# EAGLE design sensor_board011 (EAGLE 4.16)

## Sheet 1 of 2
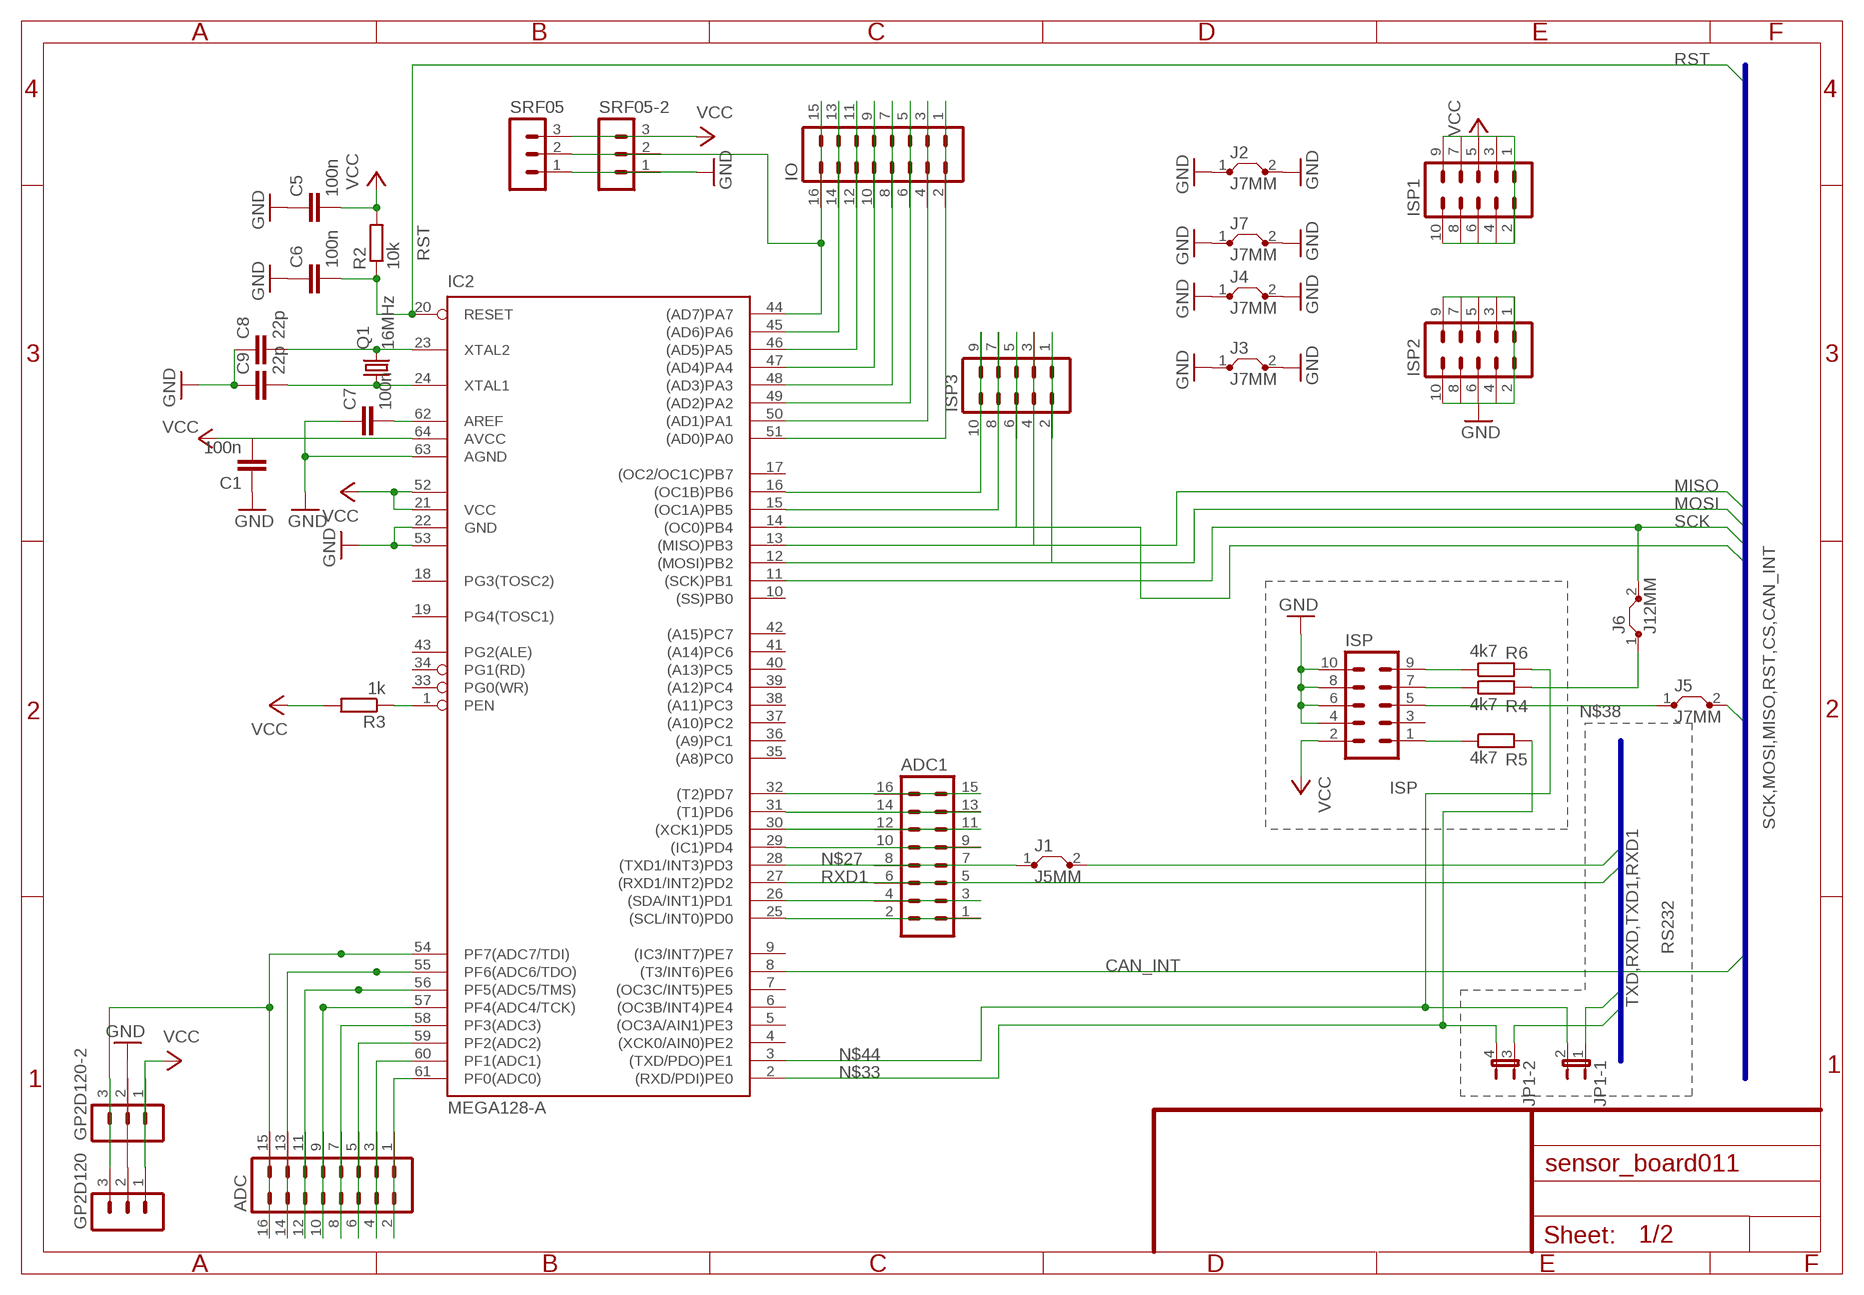
[diagram p0: schematic, sheet 1]

### Parts
ADC  MA08-2  [MA08-2]
ADC1  MA08-2  [MA08-2]
C1  100n  C-EUC0603  [C0603]
C5  100n  C-EUC0603  [C0603]
C6  100n  C-EUC0603  [C0603]
C7  100n  C-EUC0603  [C0603]
C8  22p  C-EUC0603  [C0603]
C9  22p  C-EUC0603  [C0603]
GP2D120  MA03-1  [MA03-1]
GP2D120-2  MA03-1  [MA03-1]
IC2  MEGA128-A  [TQFP64]
IO  MA08-2  [MA08-2]
ISP  MA05-2  [MA05-2]
ISP1  MA05-2  [MA05-2]
ISP2  MA05-2  [MA05-2]
ISP3  MA05-2  [MA05-2]
J1  J5MM  [05]
J2  J7MM  [07]
J3  J7MM  [07]
J4  J7MM  [07]
J5  J7MM  [07]
J6  J12MM  [12]
J7  J7MM  [07]
JP1  JP2QE  [JP2Q]
Q1  16MHz  CRYSTALHC49U-V  [HC49U-V]
R2  10k  R-EU_R0805  [R0805]
R3  1k  R-EU_R0805  [R0805]
R4  4k7  R-EU_R0805  [R0805]
R5  4k7  R-EU_R0805  [R0805]
R6  4k7  R-EU_R0805  [R0805]
SRF05  MA03-1  [MA03-1]
SRF05-2  MA03-1  [MA03-1]

### Nets
CAN_INT: IC2.8((T3/INT6)PE6) ; also sheet 2
CS: IC2.14((OC0)PB4) ISP3.5 ISP3.6 ; also sheet 2
GND: C1.1 C5.1 C6.1 C7.1 C8.1 C9.1 GP2D120-2.2 GP2D120.2 IC2.22(GND) IC2.53(GND1) IC2.63(AGND) ISP2.1 ISP2.2 ISP2.3 ISP2.4 ISP2.5 ISP2.6 ISP2.7 ISP2.8 ISP2.9 ISP2.10 ISP.4 ISP.6 ISP.8 ISP.10 J2.1 J2.2 J3.1 J3.2 J4.1 J4.2 J7.1 J7.2 SRF05-2.1 SRF05.1 ; also sheet 2
MISO: IC2.13((MISO)PB3) ISP3.3 ISP3.4 ; also sheet 2
MOSI: IC2.12((MOSI)PB2) ISP3.1 ISP3.2 ; also sheet 2
N$1: ADC.1 ADC.2 IC2.61(PF0(ADC0))
N$3: ADC.3 ADC.4 IC2.60(PF1(ADC1))
N$4: ADC.5 ADC.6 IC2.59(PF2(ADC2))
N$5: C7.2 IC2.62(AREF)
N$6: C9.2 IC2.24(XTAL1) Q1.1
N$7: C8.2 IC2.23(XTAL2) Q1.2
N$9: ADC.7 ADC.8 IC2.58(PF3(ADC3))
N$11: ADC.9 ADC.10 IC2.57(PF4(ADC4/TCK))
N$14: ADC.11 ADC.12 IC2.56(PF5(ADC5/TMS))
N$15: ADC.13 ADC.14 IC2.55(PF6(ADC6/TDO))
N$19: ADC.15 ADC.16 GP2D120-2.3 GP2D120.3 IC2.54(PF7(ADC7/TDI))
N$20: IC2.45((AD6)PA6) IO.13 IO.14
N$22: ISP.9 R6.1
N$24: IC2.46((AD5)PA5) IO.11 IO.12
N$25: ISP.1 R5.1
N$26: IC2.1(PEN) R3.1
N$27: ADC1.7 ADC1.8 IC2.28((TXD1/INT3)PD3) J1.1
N$28: IC2.47((AD4)PA4) IO.9 IO.10
N$29: ISP.7 R4.1
N$31: IC2.48((AD3)PA3) IO.7 IO.8
N$32: IC2.49((AD2)PA2) IO.5 IO.6
N$33: IC2.2((RXD/PDI)PE0) JP1.4 R5.2
N$34: IC2.50((AD1)PA1) IO.3 IO.4
N$35: IC2.51((AD0)PA0) IO.1 IO.2
N$38: ISP.5 J5.1
N$44: IC2.3((TXD/PDO)PE1) JP1.2 R6.2
N$47: IC2.44((AD7)PA7) IO.15 IO.16 SRF05-2.2 SRF05.2
N$48: J6.1 R4.2
N$52: IC2.15((OC1A)PB5) ISP3.7 ISP3.8
N$60: IC2.16((OC1B)PB6) ISP3.9 ISP3.10
N$61: ADC1.1 ADC1.2 IC2.25((SCL/INT0)PD0)
N$62: ADC1.3 ADC1.4 IC2.26((SDA/INT1)PD1)
N$63: ADC1.9 ADC1.10 IC2.29((IC1)PD4)
N$64: ADC1.11 ADC1.12 IC2.30((XCK1)PD5)
N$65: ADC1.13 ADC1.14 IC2.31((T1)PD6)
N$66: ADC1.15 ADC1.16 IC2.32((T2)PD7)
RST: C6.2 IC2.20(RESET) J5.2 R2.1 ; also sheet 2
RXD: JP1.3 ; also sheet 2
RXD1: ADC1.5 ADC1.6 IC2.27((RXD1/INT2)PD2) ; also sheet 2
SCK: IC2.11((SCK)PB1) J6.2 ; also sheet 2
TXD: JP1.1 ; also sheet 2
TXD1: J1.2 ; also sheet 2
VCC: C1.2 C5.2 GP2D120-2.1 GP2D120.1 IC2.21(VCC) IC2.52(VCC1) IC2.64(AVCC) ISP1.1 ISP1.2 ISP1.3 ISP1.4 ISP1.5 ISP1.6 ISP1.7 ISP1.8 ISP1.9 ISP1.10 ISP.2 R2.2 R3.2 SRF05-2.3 SRF05.3 ; also sheet 2
Unconnected: IC2.4((XCK0/AIN0)PE2) IC2.5((OC3A/AIN1)PE3) IC2.6((OC3B/INT4)PE4) IC2.7((OC3C/INT5)PE5) IC2.9((IC3/INT7)PE7) IC2.10((SS)PB0) IC2.17((OC2/OC1C)PB7) IC2.18(PG3(TOSC2)) IC2.19(PG4(TOSC1)) IC2.33(PG0(WR)) IC2.34(PG1(RD)) IC2.35((A8)PC0) IC2.36((A9)PC1) IC2.37((A10)PC2) IC2.38((A11)PC3) IC2.39((A12)PC4) IC2.40((A13)PC5) IC2.41((A14)PC6) IC2.42((A15)PC7) IC2.43(PG2(ALE)) ISP.3

### Buses
SCK,MOSI,MISO,RST,CS,CAN_INT
TXD,RXD,TXD1,RXD1

### Notes on the sheet
- ISP
- RS232

## Sheet 2 of 2
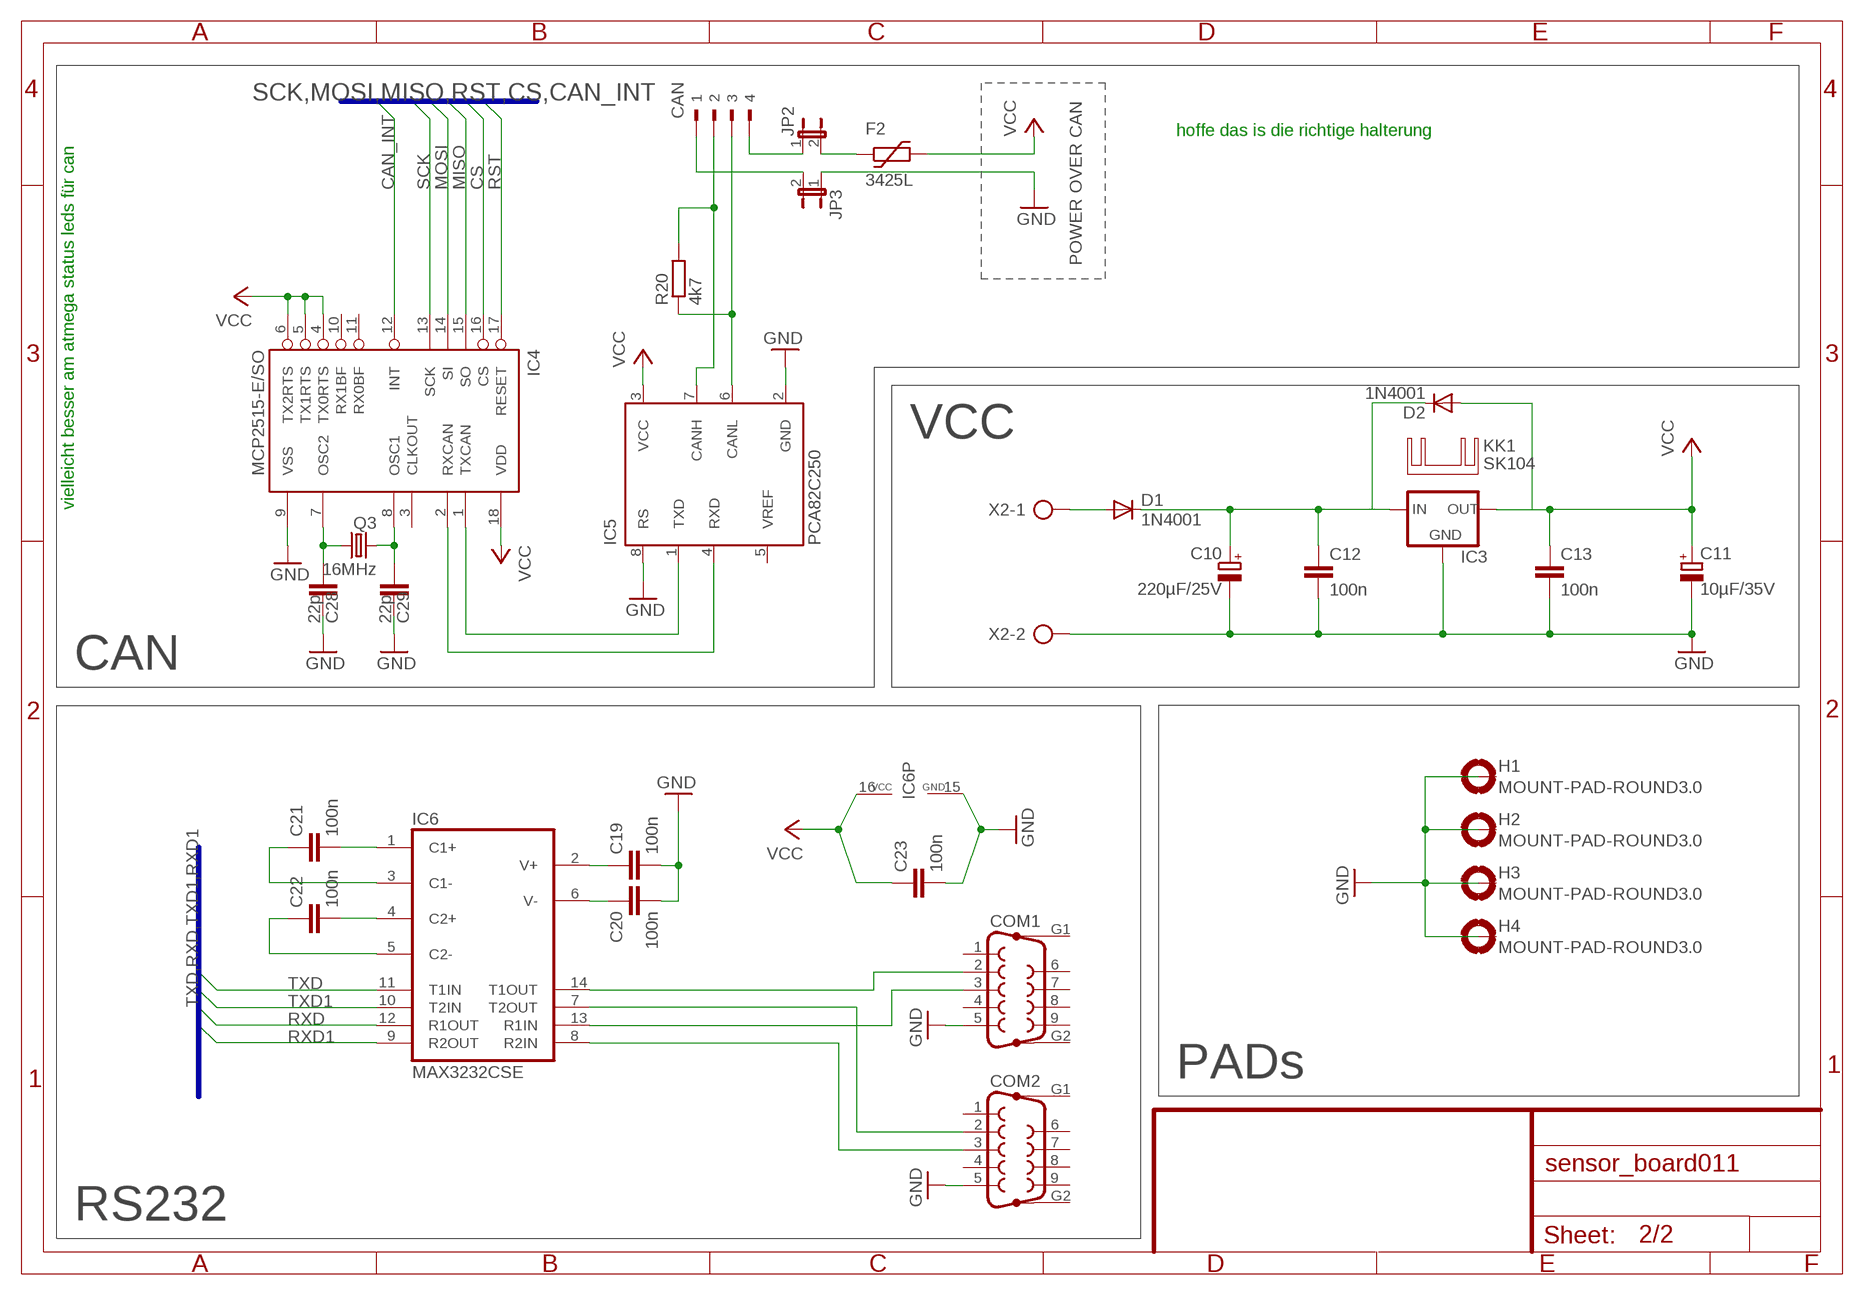
[diagram p1: schematic, sheet 2]

### Parts
C10  220µF/25V  CPOL-EUE3.5-8  [E3,5-8]
C11  10µF/35V  CPOL-EUE2-5  [E2-5]
C12  100n  C-EUC0603  [C0603]
C13  100n  C-EUC0603  [C0603]
C19  100n  C-EUC0603  [C0603]
C20  100n  C-EUC0603  [C0603]
C21  100n  C-EUC0603  [C0603]
C22  100n  C-EUC0603  [C0603]
C23  100n  C-EUC0603  [C0603]
C28  22p  C-EUC0603  [C0603]
C29  22p  C-EUC0603  [C0603]
CAN  90-4  [90-4]
COM1  F09HP  [F09HP]
COM2  F09HP  [F09HP]
D1  1N4001  DIODE-DO41-10  [DO41-10]
D2  1N4001  DIODE-DO41-10  [DO41-10]
F2  3425L  [3425L]
H1  MOUNT-PAD-ROUND3.0  [3,0-PAD]
H2  MOUNT-PAD-ROUND3.0  [3,0-PAD]
H3  MOUNT-PAD-ROUND3.0  [3,0-PAD]
H4  MOUNT-PAD-ROUND3.0  [3,0-PAD]
IC3  78XXS  [78XXS]
IC4  MCP2515-E/SO  [SO18L]
IC5  PCA82C250  [DIL08]
IC6  MAX3232CSE  [SO16]
JP2  JP1E  [JP1]
JP3  JP1E  [JP1]
KK1  SK104  [SK104]
Q3  16MHz  CRYSTALHC49U-V  [HC49U-V]
R20  4k7  R-EU_R0805  [R0805]
X2  AK500/2-H  [AK500/2-H]

### Nets
CAN_INT: IC4.12(INT) ; also sheet 1
CS: IC4.16(CS) ; also sheet 1
GND: C10.- C11.- C12.2 C13.2 C19.2 C20.2 C23.2 C28.2 C29.2 COM1.5 COM2.5 H1.B3,0(MOUNT) H2.B3,0(MOUNT) H3.B3,0(MOUNT) H4.B3,0(MOUNT) IC3.GND IC4.9(VSS) IC5.2(GND) IC5.8(RS) IC6.15(GND) JP3.1 X2.2 ; also sheet 1
MISO: IC4.15(SO) ; also sheet 1
MOSI: IC4.14(SI) ; also sheet 1
N$2: IC4.1(TXCAN) IC5.1(TXD)
N$8: C10.+ C12.1 D1.C D2.C IC3.IN
N$10: D1.A X2.1
N$12: COM1.2 IC6.14(T1OUT)
N$13: COM1.3 IC6.13(R1IN)
N$16: CAN.4 JP2.1
N$17: C21.2 IC6.1(C1+)
N$21: IC4.2(RXCAN) IC5.4(RXD)
N$23: CAN.3 IC5.6(CANL) R20.1
N$30: C22.2 IC6.4(C2+)
N$36: C22.1 IC6.5(C2-)
N$37: C21.1 IC6.3(C1-)
N$40: COM2.2 IC6.7(T2OUT)
N$41: COM2.3 IC6.8(R2IN)
N$43: C19.1 IC6.2(V+)
N$46: C20.1 IC6.6(V-)
N$49: F2.P$1 JP2.2
N$50: CAN.1 JP3.2
N$53: C28.1 IC4.7(OSC2) Q3.1
N$54: C29.1 IC4.8(OSC1) Q3.2
N$59: CAN.2 IC5.7(CANH) R20.2
RST: IC4.17(RESET) ; also sheet 1
RXD: IC6.12(R1OUT) ; also sheet 1
RXD1: IC6.9(R2OUT) ; also sheet 1
SCK: IC4.13(SCK) ; also sheet 1
TXD: IC6.11(T1IN) ; also sheet 1
TXD1: IC6.10(T2IN) ; also sheet 1
VCC: C11.+ C13.1 C23.1 D2.A F2.P$2 IC3.OUT IC4.4(TX0RTS) IC4.5(TX1RTS) IC4.6(TX2RTS) IC4.18(VDD) IC5.3(VCC) IC6.16(VCC) ; also sheet 1
Unconnected: COM1.1 COM1.4 COM1.6 COM1.7 COM1.8 COM1.9 COM1.G1 COM1.G2 COM2.1 COM2.4 COM2.6 COM2.7 COM2.8 COM2.9 COM2.G1 COM2.G2 IC4.3(CLKOUT) IC4.10(RX1BF) IC4.11(RX0BF) IC5.5(VREF)

### Buses
SCK,MOSI,MISO,RST,CS,CAN_INT
TXD,RXD,TXD1,RXD1

### Notes on the sheet
- POWER OVER CAN
- hoffe das is die richtige halterung
- VCC
- vielleicht besser am atmega status leds für can
- CAN
- PADs
- RS232

## Library data of the parts
ADC ADC1 IO = con-lstb:MA08-2: PIN HEADER
C1 C5-C9 C12 C13 C19-C23 C28 C29 = rcl:C-EU: CAPACITOR, European symbol
C10 C11 = rcl:CPOL-EU: POLARIZED CAPACITOR, European symbol
CAN = con-weidmueller-sl35:90-4: WEIDMUELLER CLAMP CONNECTOR
COM1 COM2 = con-subd:F09HP: SUB-D
D1 D2 = diode:DIODE-: DIODE
F2 = ptc-littlefuse:3425L
GP2D120 GP2D120-2 SRF05 SRF05-2 = con-lstb:MA03-1: PIN HEADER
H1-H4 = holes:MOUNT-PAD-ROUND: MOUNTING PAD, round
IC2 = atmel:MEGA128: MICROCONTROLLER 128 Kbytes FLASH 4 Kbytes SRAM 4 Kbytes EEPROM DUAL USART 8-channel 10 bit ADC Source: avr.lbr
IC3 = v-reg:78XXS: VOLTAGE REGULATOR
IC4 = mcp2515:MCP2515
IC5 = micro-philips:PCA82C250: CAN CONTROLLER INTERFACE
IC6 = maxim:MAX3232*: True RS-232 Transceivers 3.0V to 5.5V, Low-Power up to 1Mbps, Using Four 0.1µF External Capacitors Source: http://pdfserv.maxim-ic.com/en/ds/MAX3222-MAX3241.pdf
ISP ISP1-ISP3 = con-lstb:MA05-2: PIN HEADER
J1-J7 = jumper:J: Bridge
JP1 = jumper:JP2QE: JUMPER
JP2 JP3 = jumper:JP1E: JUMPER
KK1 = heatsink:SK104: HEATSINK manufacturer Fischer/distributor Buerklin
Q1 Q3 = crystal:CRYSTAL: CRYSTAL
R2-R6 R20 = rcl:R-EU_: RESISTOR, European symbol
X2 = con-ptr500:AK500/2-H: CONNECTOR Aug. 2004 / PTR Meßtechnik: Die Bezeichnung der Serie AK505 wurde geändert. Es handelt sich hierbei um AK500 in horizontaler Ausführung.

## Board
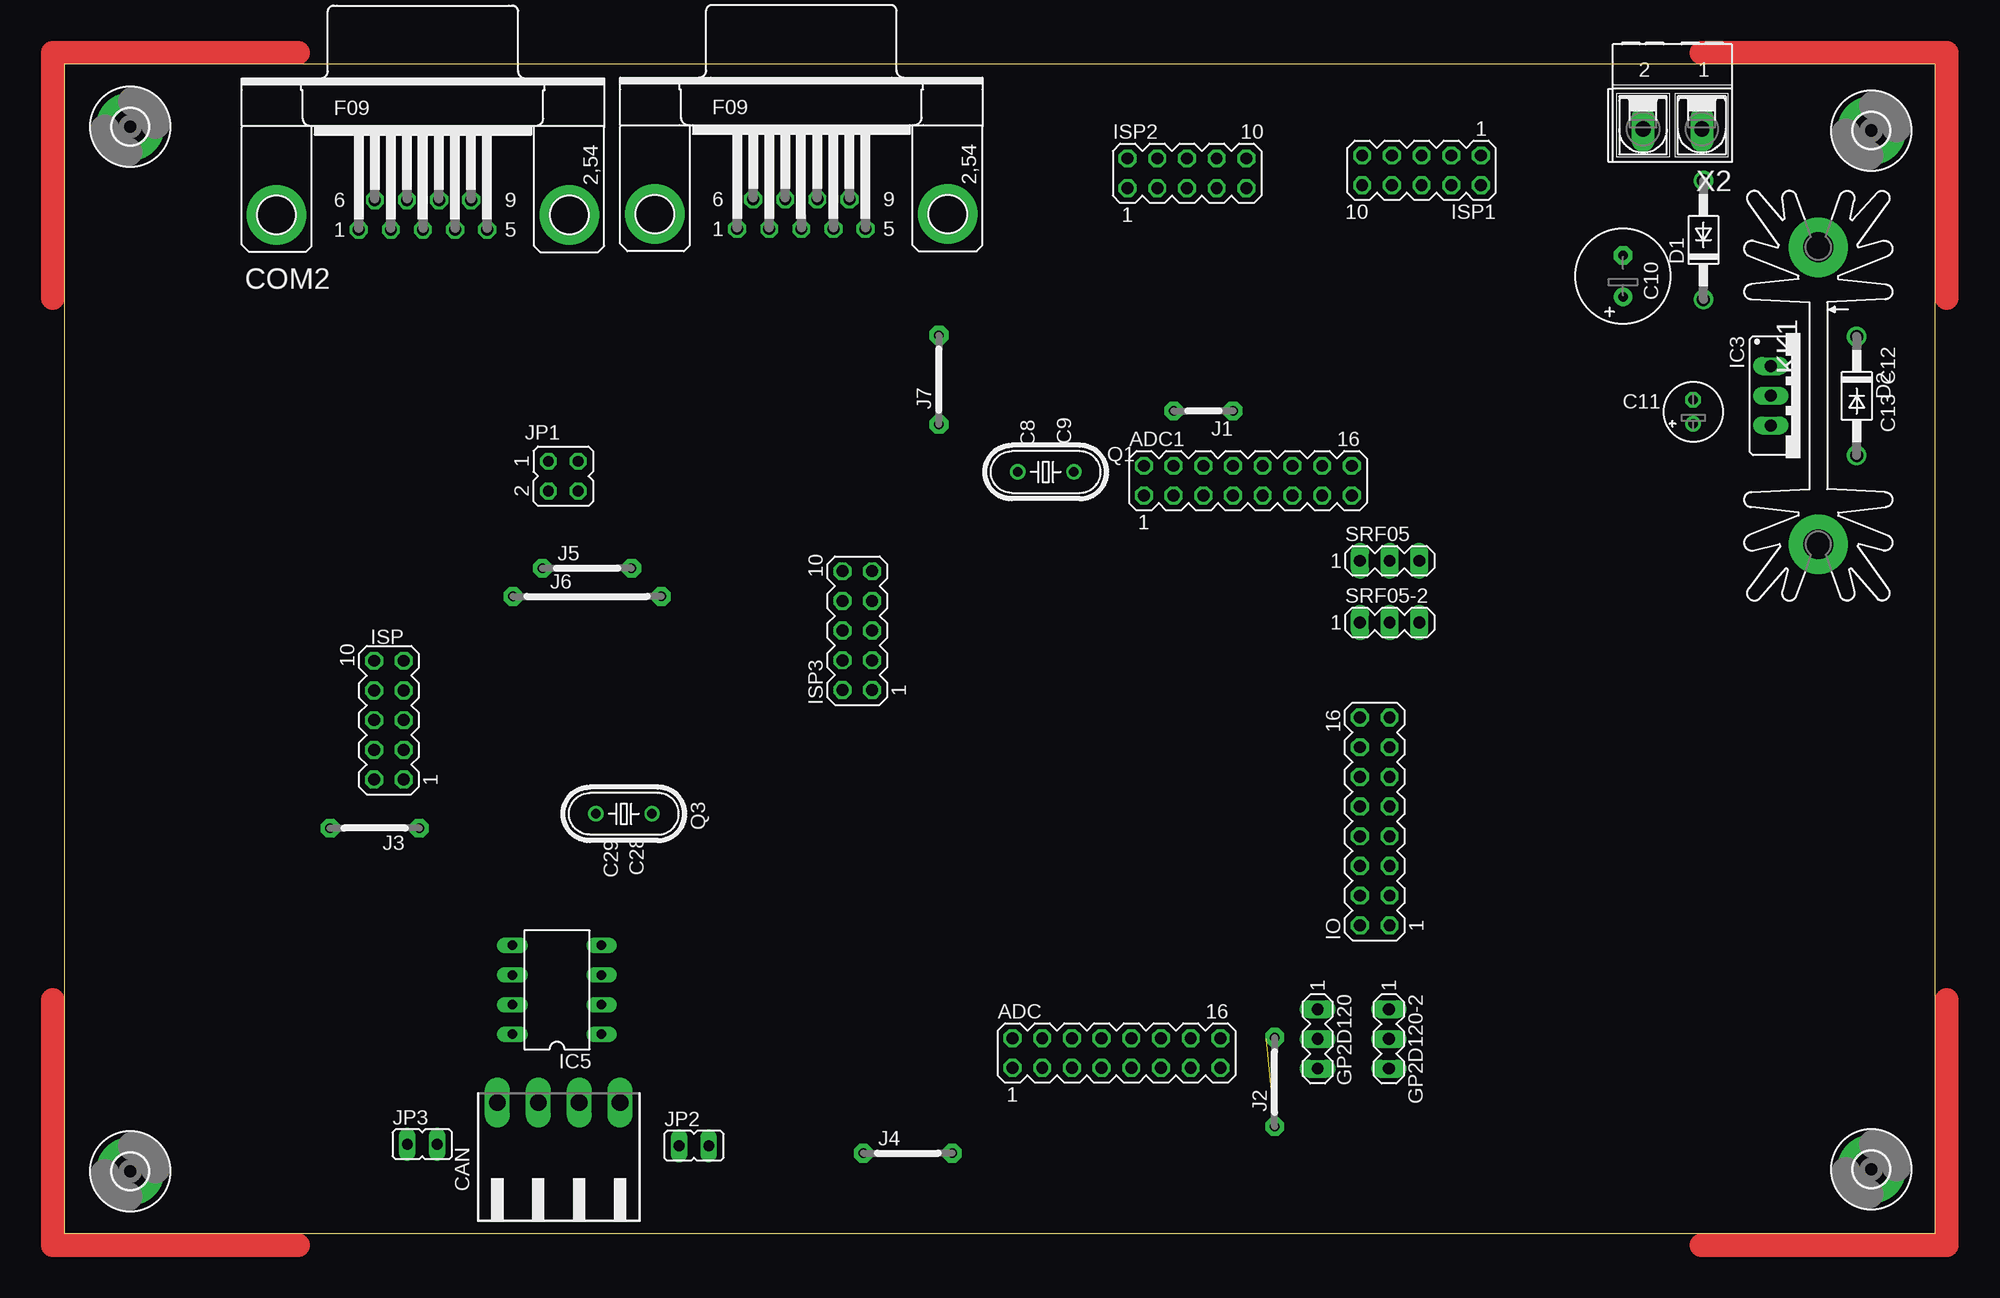
[diagram p2: board, top side]
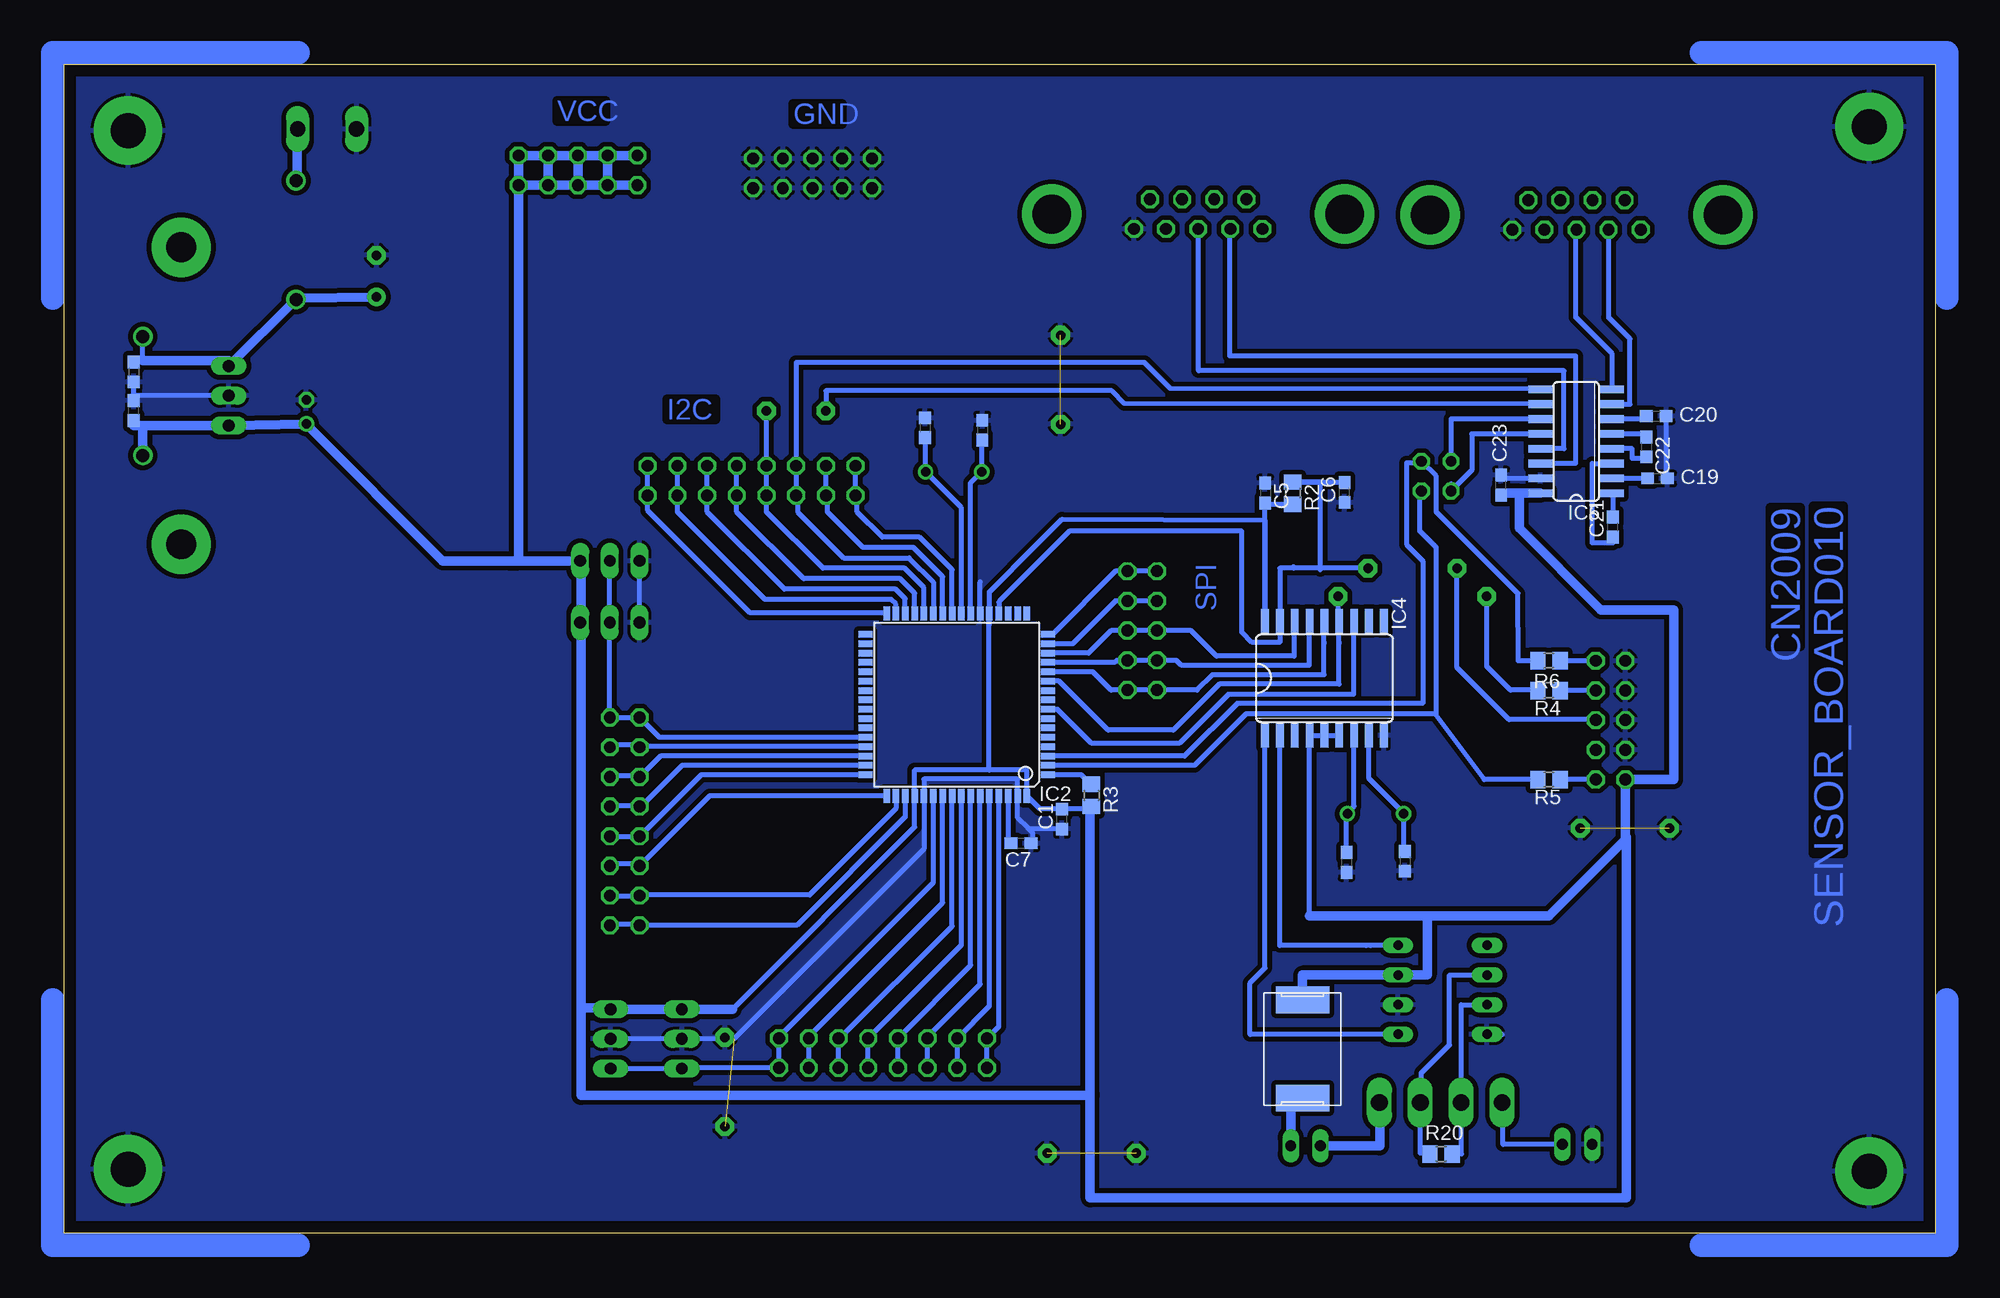
[diagram p3: board, bottom side, seen from below]

Size 160 x 100 mm. Coordinates in mm from the lower left corner, seen from the top.
Outline: 0,0 160,0 160,100 0,100 0,0
Copper layers (1*16): Top 0.035mm / dielectric 1.5mm / Bottom 0.035mm
Design rules "olimex_8mils": minimum track width 10mil, minimum drill 24mil, track to track 8mil, track to pad 8mil, pad to pad 8mil, via to via 8mil, smd to smd 8mil, copper to edge 40mil, drill to drill 10mil, minimum pad ring 10mil, minimum via ring 8mil, stop-mask expansion 0mil, vias tented up to drill 0mil, thermal gap 10mil

### Footprints (pad centres in the part's own frame; a part is rotated, then mirrored left to right if it is on the bottom)
MA08-2 = drill 1.016 octagon: 1 -8.89,-1.27; 2 -8.89,1.27; 3 -6.35,-1.27; 4 -6.35,1.27; 5 -3.81,-1.27; 6 -3.81,1.27; 7 -1.27,-1.27; 8 -1.27,1.27; 9 1.27,-1.27; 10 1.27,1.27; 11 3.81,-1.27; 12 3.81,1.27; 13 6.35,-1.27; 14 6.35,1.27; 15 8.89,-1.27; 16 8.89,1.27
C0603 = smd 1.1 x 1: 1 -0.85,0; 2 0.85,0
E3,5-8 = drill 0.813 pad 1.6 round: + -1.778,0 | drill 0.813 pad 1.6 octagon: - 1.778,0
E2-5 = drill 0.813 pad 1.27 round: + -1.016,0 | drill 0.813 pad 1.27 octagon: - 1.016,0
90-4 = drill 1.422 long: 1 -5.25,5.25; 2 -1.75,5.25; 3 1.75,5.25; 4 5.25,5.25
F09HP = drill 1.016 octagon: 1 -5.486,-1.27; 2 -2.743,-1.27; 3 0,-1.27; 4 2.743,-1.27; 5 5.486,-1.27; 6 -4.115,1.27; 7 -1.372,1.27; 8 1.372,1.27; 9 4.115,1.27 | drill 3.302 pad 5.08 round: G1 -12.522,0; G2 12.522,0
DO41-10 = drill 1.118 round: A 5.08,0; C -5.08,0
3425L = smd 2.29 x 4.57: P$1 -4.2,0; P$2 4.2,0
MA03-1 = drill 1.016 long: 1 -2.54,0; 2 0,0; 3 2.54,0
3,0-PAD = drill 3 pad 5.842 round: B3,0 0,0
TQFP64 = smd 1.194 x 0.559: 1 -7.8,6; 2 -7.8,5.2; 3 -7.8,4.4; 4 -7.8,3.6; 5 -7.8,2.8; 6 -7.8,2; 7 -7.8,1.2; 8 -7.8,0.4; 9 -7.8,-0.4; 10 -7.8,-1.2; 11 -7.8,-2; 12 -7.8,-2.8; 13 -7.8,-3.6; 14 -7.8,-4.4; 15 -7.8,-5.2; 16 -7.8,-6; 33 7.8,-6; 34 7.8,-5.2; 35 7.8,-4.4; 36 7.8,-3.6; 37 7.8,-2.8; 38 7.8,-2; 39 7.8,-1.2; 40 7.8,-0.4; 41 7.8,0.4; 42 7.8,1.2; 43 7.8,2; 44 7.8,2.8; 45 7.8,3.6; 46 7.8,4.4; 47 7.8,5.2; 48 7.8,6 | smd 0.559 x 1.194: 17 -6,-7.8; 18 -5.2,-7.8; 19 -4.4,-7.8; 20 -3.6,-7.8; 21 -2.8,-7.8; 22 -2,-7.8; 23 -1.2,-7.8; 24 -0.4,-7.8; 25 0.4,-7.8; 26 1.2,-7.8; 27 2,-7.8; 28 2.8,-7.8; 29 3.6,-7.8; 30 4.4,-7.8; 31 5.2,-7.8; 32 6,-7.8; 49 6,7.8; 50 5.2,7.8; 51 4.4,7.8; 52 3.6,7.8; 53 2.8,7.8; 54 2,7.8; 55 1.2,7.8; 56 0.4,7.8; 57 -0.4,7.8; 58 -1.2,7.8; 59 -2,7.8; 60 -2.8,7.8; 61 -3.6,7.8; 62 -4.4,7.8; 63 -5.2,7.8; 64 -6,7.8
78XXS = drill 1.016 long: GND 0,-2.54; IN -2.54,-2.54; OUT 2.54,-2.54
SO18L = smd 0.66 x 2.032: 1 -5.08,-4.902; 2 -3.81,-4.902; 3 -2.54,-4.902; 4 -1.27,-4.902; 5 0,-4.902; 6 1.27,-4.902; 7 2.54,-4.902; 8 3.81,-4.902; 9 5.08,-4.902; 10 5.08,4.902; 11 3.81,4.902; 12 2.54,4.902; 13 1.27,4.902; 14 0,4.902; 15 -1.27,4.902; 16 -2.54,4.902; 17 -3.81,4.902; 18 -5.08,4.902
DIL08 = drill 0.813 long: 1 -3.81,-3.81; 2 -1.27,-3.81; 3 1.27,-3.81; 4 3.81,-3.81; 5 3.81,3.81; 6 1.27,3.81; 7 -1.27,3.81; 8 -3.81,3.81
SO16 = smd 0.66 x 2.032: 1 -4.445,-3.073; 2 -3.175,-3.073; 3 -1.905,-3.073; 4 -0.635,-3.073; 5 0.635,-3.073; 6 1.905,-3.073; 7 3.175,-3.073; 8 4.445,-3.073; 9 4.445,3.073; 10 3.175,3.073; 11 1.905,3.073; 12 0.635,3.073; 13 -0.635,3.073; 14 -1.905,3.073; 15 -3.175,3.073; 16 -4.445,3.073
MA05-2 = drill 1.016 octagon: 1 -5.08,-1.27; 2 -5.08,1.27; 3 -2.54,-1.27; 4 -2.54,1.27; 5 0,-1.27; 6 0,1.27; 7 2.54,-1.27; 8 2.54,1.27; 9 5.08,-1.27; 10 5.08,1.27
05 = drill 0.813 pad 1.6 octagon: 1 -2.54,0; 2 2.54,0
07 = drill 0.813 pad 1.6 octagon: 1 -3.81,0; 2 3.81,0
12 = drill 0.813 pad 1.6 octagon: 1 -6.35,0; 2 6.35,0
JP2Q = drill 0.914 octagon: 1 -1.27,-1.27; 2 -1.27,1.27; 3 1.27,-1.27; 4 1.27,1.27
JP1 = drill 0.914 long: 1 0,-1.27; 2 0,1.27
SK104 = drill 2.54 pad 5.08 round: A2,5 -12.7,-0.762; B2,5 12.7,-0.762
HC49U-V = drill 0.813 round: 1 -2.413,0; 2 2.413,0
R0805 = smd 1.3 x 1.5: 1 -0.95,0; 2 0.95,0
AK500/2-H = drill 1.321 long: 1 -2.515,0; 2 2.515,0

### Placement (x,y rotation side)
ADC  89.98,15.43 0 top
ADC1  101.22,64.39 0 top
C1  74.68,35.43 90 bottom
C5  57.3,63.32 270 bottom
C6  50.51,63.39 90 bottom
C7  78.18,33.38 180 bottom
C8  81.5,68.69 270 bottom
C9  86.4,68.91 270 bottom
C10  133.3,81.88 90 top
C11  139.31,70.27 90 top
C12  154.06,73.69 270 bottom
C13  154.06,70.38 90 bottom
C19  23.75,64.58 0 bottom
C20  23.86,69.91 0 bottom
C21  27.56,60.41 90 bottom
C22  24.7,67.27 270 bottom
C23  37.12,64.01 90 bottom
C28  50.34,31.72 270 bottom
C29  45.35,31.84 270 bottom
CAN  42.28,5.94 0 top
COM1  63.03,87.19 0 top
COM2  30.67,87.12 0 top
D1  140.18,84.96 90 top
D2  153.29,71.63 270 top
F2  54.1,15.77 90 bottom
GP2D120  107.19,16.64 270 top
GP2D120-2  113.28,16.64 270 top
H1  154.55,5.5 0 top
H2  5.64,94.67 0 top
H3  5.64,5.31 0 top
H4  154.55,94.34 0 top
IC2  83.68,45.24 180 bottom
IC3  148.48,71.65 270 top
IC4  52.24,47.49 0 bottom
IC5  42.14,20.84 90 top
IC6  30.7,67.75 90 bottom
IO  112.08,35.24 90 top
ISP  27.76,43.9 90 top
ISP1  116.08,90.93 180 top
ISP2  96.01,90.68 0 top
ISP3  67.82,51.56 90 top
J1  97.41,70.36 180 top
J2  103.5,12.95 90 top
J3  26.54,34.67 180 top
J4  72.14,6.86 0 top
J5  44.7,56.9 0 top
J6  44.7,54.48 0 top
J7  74.8,73.03 90 top
JP1  42.67,64.77 270 top
JP2  53.85,7.49 270 top
JP3  30.61,7.62 270 top
KK1  150.76,71.65 270 top
Q1  83.93,65.13 180 top
Q3  47.85,35.89 180 top
R2  54.95,63.32 270 bottom
R3  72.16,37.48 270 bottom
R4  33.03,46.43 180 bottom
R5  33.03,38.81 180 bottom
R6  33.03,48.98 180 bottom
R20  42.25,6.81 0 bottom
SRF05  113.35,57.53 0 top
SRF05-2  113.35,52.26 0 top
X2  137.53,94.46 180 top

### Tracks (layer width: path | path; a pad name or v marks a point on that pad's centre or on a via)
CAN_INT
  Bottom 0.406: 49.72,50.48 49.72,50.55 | 49.72,50.48 IC4.12 | IC2.8 75.81,44.84 75.69,44.83 75.06,44.83 72.14,41.91 64.64,41.91 60.45,46.1 49.72,46.11 49.72,50.48
CS
  Bottom 0.406: 54.8,51.44 54.8,51.5 | 54.8,51.44 IC4.16 | 54.8,51.44 54.8,49.38 61.45,49.38 63.63,51.56 ISP3.6 ISP3.5 70.48,51.56 72.41,49.64 IC2.14
GND  (4 unrouted)
  Bottom 0.406: C20.2 22.99,69.91 22.99,64.58 C19.2 | C23.2 37.08,64.86 37.08,64.58 IC6.15 | 38.33,17.02 38.35,17.02 | 38.33,17.02 IC5.8 | 37.03,17.02 38.33,17.02 | 77.6,34.67 77.22,34.29 77.22,33.4 77.24,33.38 C7.1 | 77.6,34.67 78.48,35.55 IC2.63 78.48,38.86 86.48,38.86 IC2.53 86.48,32.9 102.74,16.64 GP2D120.2 GP2D120-2.2 | C1.1 77.51,34.58 77.6,34.67 | SRF05-2.1 SRF05.1 110.87,57.53 | IC3.GND 154.05,71.65 C13.2 | C12.2 C13.2 | C13.2 | IC2.22 81.68,55.73 81.66,55.75
  pour Top (isolate 0.254): -78.13,87.17 -19.47,85.98 -20.89,0.58 -79.55,1.96
  pour Bottom (isolate 0.406): 166.98,110.4 -13.96,107.16 -11.72,-8 165.1,-5.93
MISO
  Bottom 0.406: 53.53,50.48 53.53,50.55 | 53.53,50.48 IC4.15 | 53.53,50.48 53.53,48.58 64.46,48.58 64.9,49.02 ISP3.4 ISP3.3 69.98,49.02 70.16,48.84 IC2.13
MOSI
  Bottom 0.406: 52.26,50.48 52.26,50.55 | 52.26,50.48 IC4.14 | 52.26,50.48 52.26,47.78 61.82,47.78 63.12,46.48 ISP3.2 | IC2.12 72.04,48.04 70.48,46.48 ISP3.1 ISP3.2 | ISP3.2 66.42,46.48
N$1
  Bottom 0.406: IC2.61 80.08,17.71 ADC.2 81.15,16.64 81.09,16.57 ADC.1
N$2
  Bottom 0.406: IC5.1 45.95,17.02 58.59,17.02 58.59,21.43 57.31,22.7 IC4.1
N$3
  Bottom 0.406: IC2.60 80.88,19.45 ADC.4 83.63,14.41 83.69,14.35 83.63,14.29 ADC.3
N$4
  Bottom 0.406: IC2.59 81.68,21.32 86.17,16.83 ADC.6 86.11,16.64 86.17,16.57 ADC.5
N$5
  Bottom 0.406: C7.2 79.06,33.4 79.25,33.4 79.25,37.41 IC2.62
N$6
  Bottom 0.406: IC2.24 83.28,62.07 86.36,65.15 Q1.1 86.36,68.06 | 86.36,68.06 86.36,68.2 | 86.36,68.06 C9.2
N$7
  Bottom 0.406: IC2.23 82.48,64.2 81.53,65.15 Q1.2 81.53,65.13 81.53,67.84 | 81.53,67.84 81.53,67.94 | 81.53,67.84 C8.2
N$8
  Bottom 0.406: C12.1 154.06,74.68 153.29,74.68 D2.C | IC3.IN 145.94,74.68 | 140.21,79.88 D1.C 140.08,80.01
  Bottom 0.813: 145.94,74.68 153.29,74.68 | 140.21,79.88 IC3.IN | C10.+ 140.08,80.01
N$9
  Bottom 0.406: IC2.58 82.48,22.93 ADC.8 88.71,14.29 88.77,14.22 ADC.7
N$10
  Bottom 0.406: 140.08,94.49 140.08,94.46 X2.1 | D1.A 140.08,90.04
  Bottom 0.813: 140.08,90.04 140.08,94.46
N$11
  Bottom 0.406: IC2.57 83.28,24.67 91.19,16.76 ADC.10 ADC.9
N$12
  Bottom 0.406: IC6.14 30.73,65.85 30.73,75.06 60.33,75.06 60.33,85.92 | 60.33,85.92 60.33,85.98 | 60.33,85.92 COM1.2
N$13
  Bottom 0.406: IC6.13 31.75,67.12 31.75,73.79 62.99,73.79 62.99,85.92 COM1.3
N$14
  Bottom 0.406: IC2.56 84.08,26.28 93.73,16.64 ADC.12 93.79,14.29 93.85,14.22 ADC.11
N$15
  Bottom 0.406: IC2.55 84.88,28.28 96.39,16.76 ADC.14 96.39,16.64 96.33,16.57 ADC.13
N$16
  Bottom 0.406: 47.5,11.19 CAN.4
  Bottom 0.813: JP2.1 47.5,7.49 47.5,11.19
N$17
  Bottom 0.406: IC6.1 27.56,63.31 C21.2
N$18
  Top 2: 20,-1 -1,-1 -1,20
N$19
  Bottom 0.406: IC2.54 85.68,30.02 98.93,16.76 ADC.16 98.87,14.29 98.93,14.22 ADC.15 107.25,14.16 107.31,14.1 GP2D120.3 GP2D120-2.3
N$20
  Bottom 0.406: IC2.45 110.72,41.64 110.74,41.66 IO.14 110.87,41.66 110.87,41.78 113.16,41.78 IO.13
N$21
  Bottom 0.406: IC5.4 45.95,24.64 48.26,24.64 | 48.26,24.64 48.68,24.64 | IC4.2 56.05,24.64 48.26,24.64
N$22
  Bottom 0.406: 32,48.98 R6.1 | ISP.9 32,48.98 | 32,48.98 32,49.02
N$23
  Bottom 0.406: 43.94,11.18 43.94,11.19 CAN.3 | 43.2,6.86 43.18,6.86 | R20.1 43.2,6.86 | CAN.3 44.03,6.86 43.2,6.86 | IC5.6 41.53,22.11 41.53,16.13 43.94,13.72 43.94,11.18 | 43.94,11.18 44.01,11.18 CAN.3
N$24
  Bottom 0.406: IC2.46 109.02,40.84 IO.12 110.87,39.12 113.41,39.12 IO.11
N$25
  Bottom 0.406: 31.88,38.82 31.88,38.81 R5.1 | ISP.1 31.88,38.82 | 31.88,38.82 31.88,38.86
N$26
  Bottom 0.406: 72.16,38.38 72.14,38.35 | R3.1 72.16,38.38 | IC2.1 73.02,39.24 72.16,38.38
N$27
  Bottom 0.406: ADC1.7 ADC1.8 | ADC1.7 ADC1.8 | ADC1.8 J1.1 | IC2.28 86.48,55.24 88.14,56.9 95.12,56.9 99.95,61.72 ADC1.7
N$28
  Bottom 0.406: IC2.47 107.16,40.04 110.74,36.45 IO.10 110.87,36.58 113.28,36.58 IO.9
N$29
  Bottom 0.406: 32,46.44 32,46.43 R4.1 | ISP.7 32,46.44 | 32,46.44 32,46.48
N$30
  Bottom 0.406: IC6.4 25.91,67.12 25.91,66.29 24.77,66.29 24.77,66.42 C22.2
N$31
  Bottom 0.406: IC2.48 105.54,39.24 IO.8 110.87,33.91 113.28,33.91 IO.7
N$32
  Bottom 0.406: IC2.49 104.8,37.44 IO.6 110.87,31.5 110.87,31.62 113.16,31.62 IO.5
N$33
  Bottom 0.406: IC2.2 63.34,40.04 58.93,44.45 42.67,44.45 | 43.81,63.5 JP1.4 44.07,63.5 44.07,60.07 42.67,58.67 42.67,44.45 | 42.67,44.45 42.67,44.32 38.56,38.81 R5.2
N$34
  Bottom 0.406: IC2.50 88.88,36.34 96.27,28.96 110.87,28.96 IO.4 110.87,28.83 113.28,28.83 IO.3
N$35
  Bottom 0.406: IC2.51 88.08,35.62 97.35,26.35 IO.2 110.87,26.42 113.28,26.42 IO.1
N$36
  Bottom 0.406: C22.1 24.77,68.12 24.77,68.39 IC6.5
N$37
  Bottom 0.406: IC6.3 29.34,65.85 29.34,59.05 27.56,59.05 C21.1
N$38
  Bottom 0.406: J5.1 40.89,48.39 36.45,43.94 29.08,43.94 ISP.5 | ISP.5 28.96,43.81 | ISP.5
N$39
  Top 2: 140,-1 161,-1 161,20
N$40
  Bottom 0.406: IC6.7 26.1,70.93 26.1,76.52 27.94,78.36 27.93,78.37 COM2.2
N$41
  Bottom 0.406: COM2.3 30.73,85.85 30.73,78.36 27.62,75.25 IC6.8
N$43
  Bottom 0.406: C19.1 24.51,64.58 | 24.51,64.58 IC6.2 | 24.51,64.58 24.51,64.64
N$44
  Bottom 0.406: IC2.3 64.19,40.84 59.69,45.34 43.81,45.34 43.81,57.53 45.21,58.93 45.21,65.91 43.94,65.91 JP1.2 42.67,64.77 42.67,61.72 35.69,54.74 35.65,48.98 R6.2
N$45
  Top 2: 20,101 -1,101 -1,80
N$46
  Bottom 0.406: 24.77,69.91 24.77,69.98 | C20.1 24.77,69.91 | IC6.6 24.77,69.66 24.77,69.91
N$47
  Bottom 0.406: IC2.44 109.11,42.44 IO.16 110.87,44.07 113.41,44.07 | 113.41,44.07 113.54,44.07 | 113.41,44.07 IO.15 SRF05-2.2 | SRF05-2.2 113.35,52.32 113.28,52.32 | 113.35,57.66 SRF05.2 | SRF05-2.2 113.35,57.66 | 113.35,57.66 113.41,57.66
N$48
  Bottom 0.406: J6.1 38.35,48.51 36.32,46.48 33.91,46.48 33.96,46.43 R4.2
N$49
  Bottom 0.406: 54.1,11.68 F2.P$1 54.1,11.56 55.12,11.56
  Bottom 0.813: JP2.2 55.12,11.56
N$50
  Bottom 0.406: CAN.1 36.96,11.19 36.96,7.62 JP3.2
N$51
  Top 2: 161,80 161,101 140,101
N$52
  Bottom 0.406: IC2.15 73.77,50.44 70.1,54.1 ISP3.7 ISP3.8
N$53
  Bottom 0.406: IC4.7 49.7,36.54 50.29,35.94 50.27,35.92 Q3.1 50.27,35.84 50.34,35.76 C28.1
N$54
  Bottom 0.406: IC4.8 48.42,38.9 45.44,35.92 Q3.2 45.44,32.99 45.34,32.89 45.35,32.88 C29.1
N$55
  Bottom 2: 20,-1 -1,-1 -1,20
N$56
  Bottom 2: 140,-1 161,-1 161,20
N$57
  Bottom 2: 20,101 -1,101 -1,80
N$58
  Bottom 2: 161,80 161,101 140,101
N$59
  Bottom 0.406: R20.2 40.51,6.81 40.51,11.19 CAN.2 40.53,19.56 38.33,19.56 | 38.33,19.56 38.23,19.56 | 38.33,19.56 IC5.7
N$60
  Bottom 0.406: IC2.16 75.51,51.24 70.1,56.64 ISP3.9 ISP3.10
N$61
  Bottom 0.406: ADC1.2 ADC1.1 92.2,62.99 92.2,61.72 90.04,59.56 86.87,59.56 84.08,56.77 IC2.25
N$62
  Bottom 0.406: ADC1.4 ADC1.3 94.74,62.99 94.74,61.72 91.69,58.67 87.38,58.67 84.88,56.18 IC2.26
N$63
  Bottom 0.406: IC2.29 87.28,54.77 88.52,56.01 96.77,56.01 102.49,61.72 ADC1.9 ADC1.10
N$64
  Bottom 0.406: IC2.30 88.08,54.3 88.9,55.12 98.42,55.12 105.03,61.72 ADC1.11 ADC1.12
N$65
  Bottom 0.406: IC2.31 88.88,53.83 89.28,54.23 100.08,54.23 107.57,61.72 ADC1.13 ADC1.14
N$66
  Bottom 0.406: IC2.32 89.66,53.06 89.66,53.09 101.35,53.09 110.11,61.85 ADC1.15 ADC1.16
RST
  Bottom 0.406: IC2.20 80.08,53.98 80.01,54.1 74.04,60.07 59.31,60.07 59.31,51.44 58.42,50.55 56.05,50.55 IC4.17 56.05,56.9 54.86,56.9 | J5.2 52.58,56.9 | 52.58,56.9 54.86,56.9 | 54.86,56.9 54.86,57.02 54.9,57.02 | R2.1 54.99,64.26 | R2.1 52.58,64.27 52.58,56.9 | C6.2 50.51,64.26 R2.1 | 52.58,56.9 52.58,56.77
RXD
  Bottom 0.406: 41.4,64.14 JP1.3 39.62,65.28 39.62,68.39 IC6.12
RXD1
  Bottom 0.406: IC6.9 65.41,72.26 67.63,74.49 97.41,74.49 ADC1.6 | ADC1.6 ADC1.5 | ADC1.6 ADC1.5 | IC2.27 85.68,55.71 87.76,57.78 93.34,57.78 97.28,61.72 97.28,62.99 ADC1.5
SCK
  Bottom 0.406: 50.99,50.48 50.99,50.55 | 50.99,50.48 IC4.13 51.05,52.39 J6.2 | IC2.11 74.92,47.24 70.74,43.05 65.15,43.05 61.22,46.98 50.99,46.98 50.99,50.48
TXD
  Bottom 0.406: IC6.11 41.4,69.66 JP1.1
TXD1
  Bottom 0.406: IC6.10 69.34,70.99 70.42,72.07 94.87,72.07 J1.2
VCC
  Bottom 0.406: 37.08,63.25 37.08,63.16 C23.1 37.12,63.25 37.08,63.25 | 37.08,63.31 37.08,63.25 | R3.2 72.26,36.43 72.26,36.32 74.64,36.32 C1.2 74.68,36.32 76.56,36.32 IC2.64 77.68,39.62 80.9,39.62 | 80.9,39.62 87.28,39.62 IC2.52 87.28,34.77 102.87,19.18 | 113.41,19.18 GP2D120-2.1 113.28,19.3 113.16,19.3 | 107.31,19.18 GP2D120.1 | 115.82,52.32 SRF05-2.3 | 115.82,57.47 SRF05.3 | 145.92,69.09 145.94,69.09 IC3.OUT | 154.06,69.09 C13.1 | 72.26,11.94 72.26,11.81 | 53.51,27.18 IC4.4 53.59,42.58 | 45.95,22.1 IC5.3 | 80.9,39.62 80.9,52.07 | 80.9,52.07 80.9,52.39 | 80.9,52.07 80.9,53.04 IC2.21 80.88,54.88 78.93,56.83 78.87,56.9 74.68,61.09 57.34,61.02 57.34,52.13 57.31,52.16 IC4.18 57.31,62.48 57.3,62.48 | 35.56,63.31 35.56,63.37 | 26.49,33.71 26.49,33.91 26.42,33.91 | 57.3,62.48 57.28,62.48 | 57.3,62.48 C5.2 57.28,62.47 57.28,62.48 | R2.2 57.28,62.37 57.28,62.48 | 52.2,42.58 IC4.5 53.59,42.58 | 52.2,42.58 IC4.6 | 52.2,42.58 52.2,42.55 | 53.59,42.58 53.59,42.55 | 139.32,69.22 C11.+ 139.31,69.23 139.32,69.22
  Bottom 0.813: 35.56,63.31 37.08,63.31 | 35.56,63.31 IC6.16 | IC5.3 54.1,22.11 F2.P$2 | GP2D120-2.1 107.31,19.18 102.87,19.18 | 115.82,57.47 115.82,52.32 115.82,19.3 | 115.82,19.3 113.28,19.3 | 145.94,69.09 153.29,69.09 | 153.29,69.09 154.06,69.09 | IC3.OUT 139.32,69.22 127.64,57.53 122.05,57.53 | SRF05.3 122.05,57.53 | 72.26,36.32 72.26,11.94 72.26,3.05 26.42,3.05 26.42,33.91 | 72.26,11.81 115.82,11.81 115.82,19.3 | 43.43,27.18 53.51,27.18 | 43.43,27.18 43.43,22.1 45.95,22.1 | 43.43,27.18 33.02,27.18 26.49,33.71 | 35.56,63.31 35.56,60.33 28.57,53.34 22.35,53.34 22.35,38.82 ISP.2 26.49,33.91 | 153.29,69.09 D2.A | ISP1.2 121.16,57.53 122.05,57.53 | 110.87,89.66 ISP1.10 ISP1.8 | ISP1.2 ISP1.4 | ISP1.4 ISP1.6 | ISP1.6 ISP1.8 | ISP1.1 121.28,92.2 | ISP1.1 ISP1.3 | ISP1.3 ISP1.5 | ISP1.5 ISP1.7 | ISP1.7 ISP1.9 | ISP1.2 121.16,89.53 | 121.16,89.53 ISP1.1 | 121.16,89.53 121.03,89.53 | ISP1.4 ISP1.3 | ISP1.6 ISP1.5 | ISP1.7 113.54,92.33 | ISP1.8 ISP1.7

### Text on the board
Bottom: GND | VCC | I2C | SENSOR_BOARD010 | CN2009 | SPI